# Altium schematic sheet lowpass-filters.SchDoc
size A3; SheetNumber: 1; SheetTotal: 6
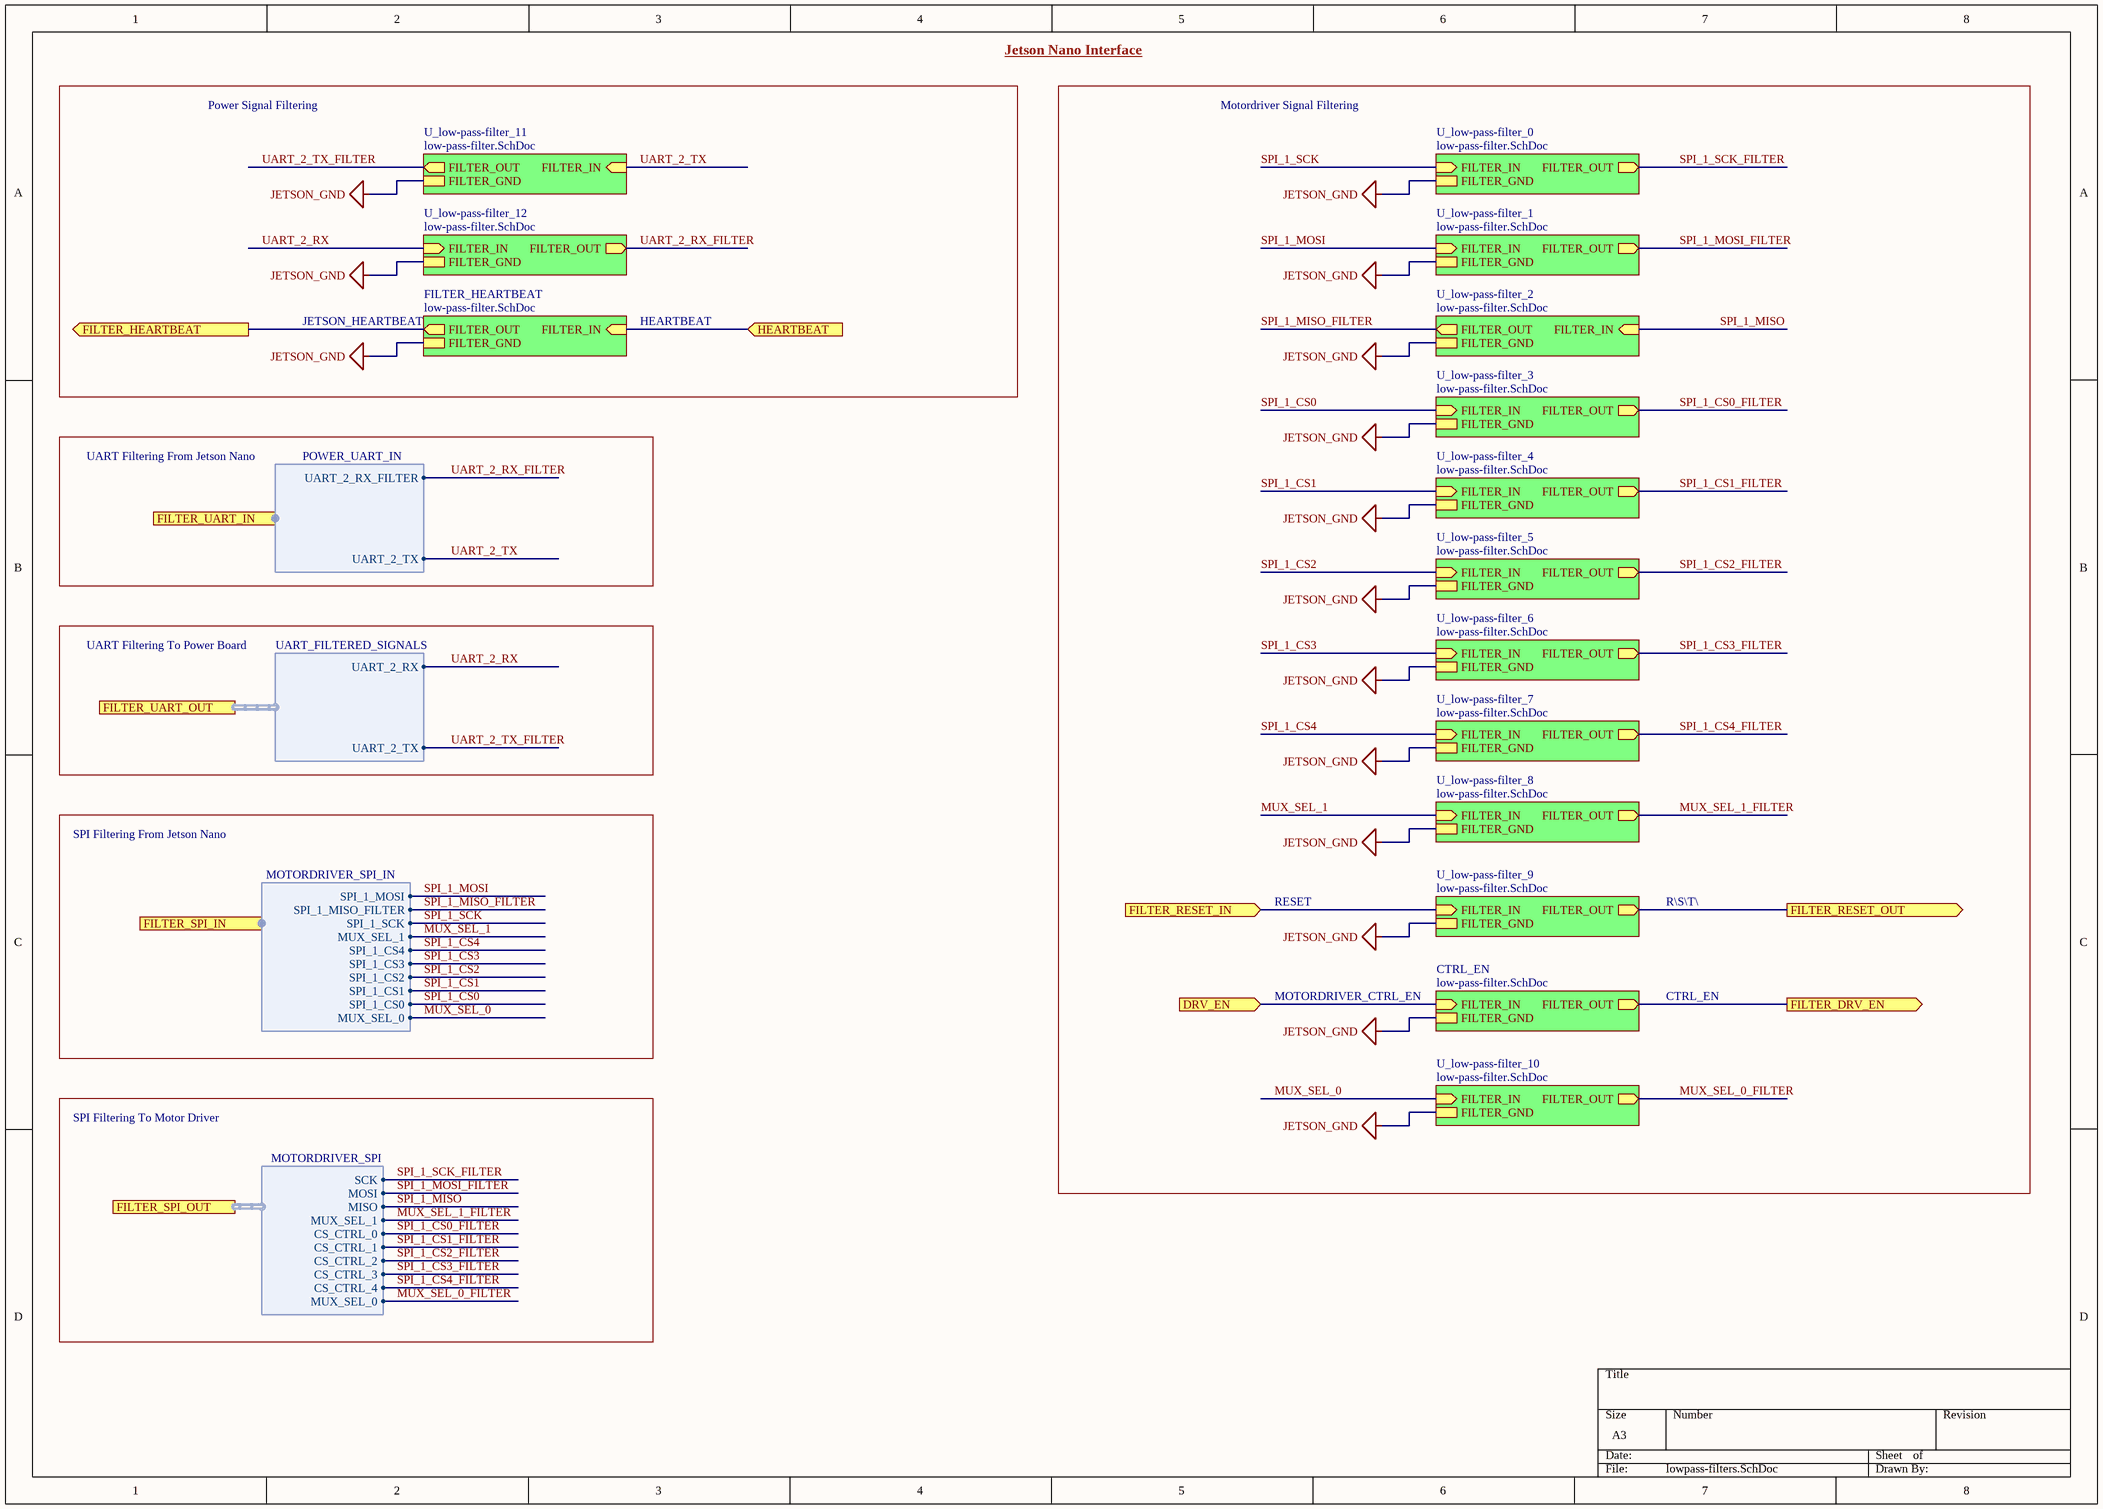
[diagram p0: lowpass-filters.SchDoc]

## Sub-sheets
CTRL_EN = low-pass-filter.SchDoc: FILTER_OUT (out), FILTER_IN (in), FILTER_GND
FILTER_HEARTBEAT = low-pass-filter.SchDoc: FILTER_IN (in), FILTER_OUT (out), FILTER_GND
U_low-pass-filter_0 = low-pass-filter.SchDoc: FILTER_OUT (out), FILTER_IN (in), FILTER_GND
U_low-pass-filter_1 = low-pass-filter.SchDoc: FILTER_OUT (out), FILTER_IN (in), FILTER_GND
U_low-pass-filter_2 = low-pass-filter.SchDoc: FILTER_IN (in), FILTER_OUT (out), FILTER_GND
U_low-pass-filter_3 = low-pass-filter.SchDoc: FILTER_OUT (out), FILTER_IN (in), FILTER_GND
U_low-pass-filter_4 = low-pass-filter.SchDoc: FILTER_OUT (out), FILTER_IN (in), FILTER_GND
U_low-pass-filter_5 = low-pass-filter.SchDoc: FILTER_OUT (out), FILTER_IN (in), FILTER_GND
U_low-pass-filter_6 = low-pass-filter.SchDoc: FILTER_OUT (out), FILTER_IN (in), FILTER_GND
U_low-pass-filter_7 = low-pass-filter.SchDoc: FILTER_OUT (out), FILTER_IN (in), FILTER_GND
U_low-pass-filter_8 = low-pass-filter.SchDoc: FILTER_OUT (out), FILTER_IN (in), FILTER_GND
U_low-pass-filter_9 = low-pass-filter.SchDoc: FILTER_OUT (out), FILTER_IN (in), FILTER_GND
U_low-pass-filter_10 = low-pass-filter.SchDoc: FILTER_OUT (out), FILTER_IN (in), FILTER_GND
U_low-pass-filter_11 = low-pass-filter.SchDoc: FILTER_OUT (out), FILTER_IN (in), FILTER_GND
U_low-pass-filter_12 = low-pass-filter.SchDoc: FILTER_OUT (out), FILTER_IN (in), FILTER_GND

## Ports
DRV_EN (in), FILTER_DRV_EN (out), FILTER_HEARTBEAT (out), FILTER_RESET_IN (in), FILTER_RESET_OUT (out), FILTER_SPI_IN (harness MOTORDRIVER_SPI_IN), FILTER_SPI_OUT (harness MOTORDRIVER_SPI), FILTER_UART_IN (harness POWER_UART_IN), FILTER_UART_OUT (harness UART_FILTERED_SIGNALS), HEARTBEAT (in)

## Harnesses
MOTORDRIVER_SPI_IN: SPI_1_CS0, MUX_SEL_1, SPI_1_SCK, SPI_1_MOSI, SPI_1_MISO_FILTER, SPI_1_CS1, SPI_1_CS2, SPI_1_CS3, SPI_1_CS4, MUX_SEL_0
MOTORDRIVER_SPI: CS_CTRL_0, MUX_SEL_1, SCK, MOSI, MISO, CS_CTRL_1, CS_CTRL_2, CS_CTRL_3, CS_CTRL_4, MUX_SEL_0
UART_FILTERED_SIGNALS: UART_2_TX, UART_2_RX
POWER_UART_IN: UART_2_TX, UART_2_RX_FILTER

## Nets
JETSON_GND: sheet U_low-pass-filter_8/FILTER_GND, sheet U_low-pass-filter_0/FILTER_GND, sheet U_low-pass-filter_1/FILTER_GND, sheet U_low-pass-filter_2/FILTER_GND, sheet U_low-pass-filter_3/FILTER_GND, sheet U_low-pass-filter_4/FILTER_GND, sheet U_low-pass-filter_5/FILTER_GND, sheet U_low-pass-filter_6/FILTER_GND, sheet U_low-pass-filter_7/FILTER_GND, sheet U_low-pass-filter_9/FILTER_GND, sheet CTRL_EN/FILTER_GND, sheet U_low-pass-filter_11/FILTER_GND, sheet U_low-pass-filter_12/FILTER_GND, sheet FILTER_HEARTBEAT/FILTER_GND, sheet U_low-pass-filter_10/FILTER_GND
DRV_EN: port DRV_EN, sheet CTRL_EN/FILTER_IN
FILTER_DRV_EN: port FILTER_DRV_EN, sheet CTRL_EN/FILTER_OUT
FILTER_HEARTBEAT: port FILTER_HEARTBEAT, sheet FILTER_HEARTBEAT/FILTER_OUT
FILTER_RESET_IN: port FILTER_RESET_IN, sheet U_low-pass-filter_9/FILTER_IN
FILTER_RESET_OUT: port FILTER_RESET_OUT, sheet U_low-pass-filter_9/FILTER_OUT
HEARTBEAT: port HEARTBEAT, sheet FILTER_HEARTBEAT/FILTER_IN
MUX_SEL_0: sheet U_low-pass-filter_10/FILTER_IN, port FILTER_SPI_IN.MUX_SEL_0
MUX_SEL_0_FILTER: sheet U_low-pass-filter_10/FILTER_OUT, port FILTER_SPI_OUT.MUX_SEL_0
MUX_SEL_1: sheet U_low-pass-filter_8/FILTER_IN, port FILTER_SPI_IN.MUX_SEL_1
MUX_SEL_1_FILTER: sheet U_low-pass-filter_8/FILTER_OUT, port FILTER_SPI_OUT.MUX_SEL_1
SPI_1_CS0: sheet U_low-pass-filter_3/FILTER_IN, port FILTER_SPI_IN.SPI_1_CS0
SPI_1_CS0_FILTER: sheet U_low-pass-filter_3/FILTER_OUT, port FILTER_SPI_OUT.CS_CTRL_0
SPI_1_CS1: sheet U_low-pass-filter_4/FILTER_IN, port FILTER_SPI_IN.SPI_1_CS1
SPI_1_CS1_FILTER: sheet U_low-pass-filter_4/FILTER_OUT, port FILTER_SPI_OUT.CS_CTRL_1
SPI_1_CS2: sheet U_low-pass-filter_5/FILTER_IN, port FILTER_SPI_IN.SPI_1_CS2
SPI_1_CS2_FILTER: sheet U_low-pass-filter_5/FILTER_OUT, port FILTER_SPI_OUT.CS_CTRL_2
SPI_1_CS3: sheet U_low-pass-filter_6/FILTER_IN, port FILTER_SPI_IN.SPI_1_CS3
SPI_1_CS3_FILTER: sheet U_low-pass-filter_6/FILTER_OUT, port FILTER_SPI_OUT.CS_CTRL_3
SPI_1_CS4: sheet U_low-pass-filter_7/FILTER_IN, port FILTER_SPI_IN.SPI_1_CS4
SPI_1_CS4_FILTER: sheet U_low-pass-filter_7/FILTER_OUT, port FILTER_SPI_OUT.CS_CTRL_4
SPI_1_MISO: sheet U_low-pass-filter_2/FILTER_IN, port FILTER_SPI_OUT.MISO
SPI_1_MISO_FILTER: sheet U_low-pass-filter_2/FILTER_OUT, port FILTER_SPI_IN.SPI_1_MISO_FILTER
SPI_1_MOSI: sheet U_low-pass-filter_1/FILTER_IN, port FILTER_SPI_IN.SPI_1_MOSI
SPI_1_MOSI_FILTER: sheet U_low-pass-filter_1/FILTER_OUT, port FILTER_SPI_OUT.MOSI
SPI_1_SCK: sheet U_low-pass-filter_0/FILTER_IN, port FILTER_SPI_IN.SPI_1_SCK
SPI_1_SCK_FILTER: sheet U_low-pass-filter_0/FILTER_OUT, port FILTER_SPI_OUT.SCK
UART_2_RX: sheet U_low-pass-filter_12/FILTER_IN, port FILTER_UART_OUT.UART_2_RX
UART_2_RX_FILTER: sheet U_low-pass-filter_12/FILTER_OUT, port FILTER_UART_IN.UART_2_RX_FILTER
UART_2_TX: sheet U_low-pass-filter_11/FILTER_IN, port FILTER_UART_IN.UART_2_TX
UART_2_TX_FILTER: sheet U_low-pass-filter_11/FILTER_OUT, port FILTER_UART_OUT.UART_2_TX

## Notes on the sheet
- Power Signal Filtering
- Jetson Nano Interface
- Motordriver Signal Filtering
- JETSON_HEARTBEAT
- HEARTBEAT
- UART Filtering From Jetson Nano
- UART Filtering To Power Board
- SPI Filtering From Jetson Nano
- RESET
- R\S\T\
- MOTORDRIVER_CTRL_EN
- CTRL_EN
- SPI Filtering To Motor Driver